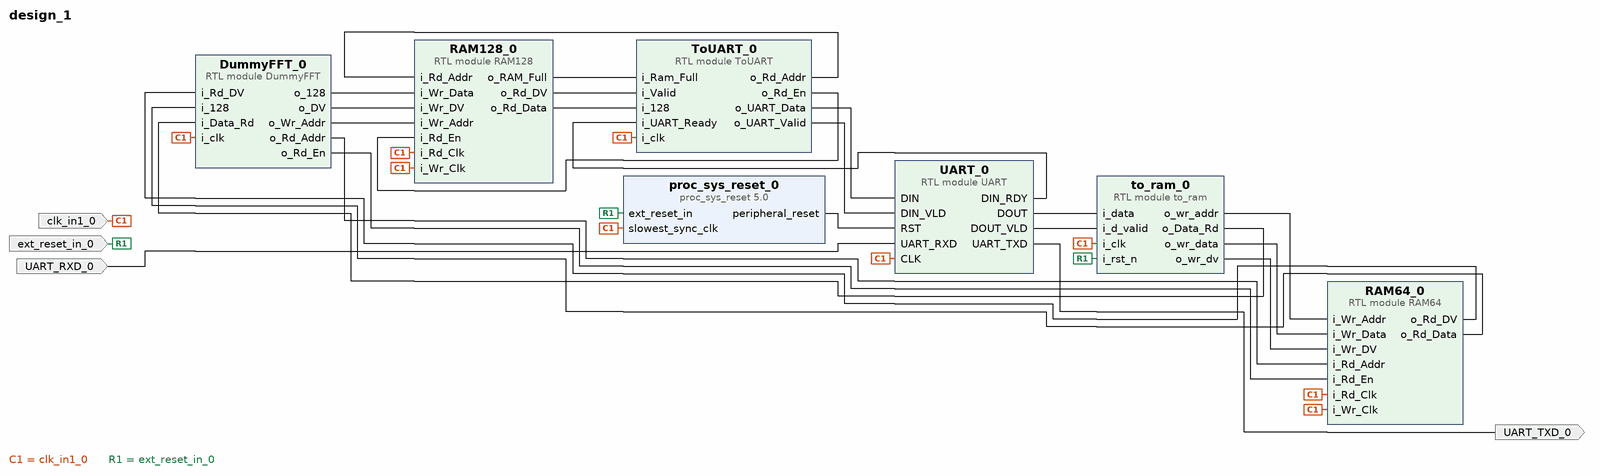
[diagram p0: block diagram of the top level]
# Vivado block design design_1, xc7s25csga324-1, Vivado 2025.1
create_bd_design design_1

create_bd_port -dir I UART_RXD_0
create_bd_port -dir O UART_TXD_0
create_bd_port -dir I -type clk clk_in1_0
set_property -dict {CONFIG.ASSOCIATED_RESET ext_reset_in_0} [get_bd_ports clk_in1_0]
create_bd_port -dir I -type rst ext_reset_in_0

create_bd_cell -type module -reference UART UART_0
create_bd_cell -type ip -vlnv xilinx.com:ip:proc_sys_reset:5.0 proc_sys_reset_0
create_bd_cell -type module -reference to_ram to_ram_0
create_bd_cell -type module -reference ToUART ToUART_0
create_bd_cell -type module -reference RAM64 RAM64_0
create_bd_cell -type module -reference RAM128 RAM128_0
create_bd_cell -type module -reference DummyFFT DummyFFT_0

# ---- connections ----

connect_bd_net [get_bd_pins DummyFFT_0/o_128] [get_bd_pins RAM128_0/i_Wr_Data]
connect_bd_net [get_bd_pins DummyFFT_0/o_DV] [get_bd_pins RAM128_0/i_Wr_DV]
connect_bd_net [get_bd_pins DummyFFT_0/o_Rd_Addr] [get_bd_pins RAM64_0/i_Rd_Addr]
connect_bd_net [get_bd_pins DummyFFT_0/o_Rd_En] [get_bd_pins RAM64_0/i_Rd_En]
connect_bd_net [get_bd_pins DummyFFT_0/o_Wr_Addr] [get_bd_pins RAM128_0/i_Wr_Addr]
connect_bd_net [get_bd_pins RAM128_0/o_RAM_Full] [get_bd_pins ToUART_0/i_Ram_Full]
connect_bd_net [get_bd_pins RAM128_0/o_Rd_DV] [get_bd_pins ToUART_0/i_Valid]
connect_bd_net [get_bd_pins RAM128_0/o_Rd_Data] [get_bd_pins ToUART_0/i_128]
connect_bd_net [get_bd_pins RAM64_0/o_Rd_DV] [get_bd_pins DummyFFT_0/i_Rd_DV]
connect_bd_net [get_bd_pins RAM64_0/o_Rd_Data] [get_bd_pins DummyFFT_0/i_128]
connect_bd_net [get_bd_pins ToUART_0/o_Rd_Addr] [get_bd_pins RAM128_0/i_Rd_Addr]
connect_bd_net [get_bd_pins ToUART_0/o_Rd_En] [get_bd_pins RAM128_0/i_Rd_En]
connect_bd_net [get_bd_pins ToUART_0/o_UART_Data] [get_bd_pins UART_0/DIN]
connect_bd_net [get_bd_pins ToUART_0/o_UART_Valid] [get_bd_pins UART_0/DIN_VLD]
connect_bd_net [get_bd_pins UART_0/DIN_RDY] [get_bd_pins ToUART_0/i_UART_Ready]
connect_bd_net [get_bd_pins UART_0/DOUT] [get_bd_pins to_ram_0/i_data]
connect_bd_net [get_bd_pins UART_0/DOUT_VLD] [get_bd_pins to_ram_0/i_d_valid]
connect_bd_net [get_bd_pins UART_0/UART_TXD] [get_bd_ports UART_TXD_0]
connect_bd_net -net UART_RXD_0_1 [get_bd_ports UART_RXD_0] [get_bd_pins UART_0/UART_RXD]
connect_bd_net -net clk_wiz_1_clk_out1 [get_bd_ports clk_in1_0] \
  [get_bd_pins proc_sys_reset_0/slowest_sync_clk] [get_bd_pins UART_0/CLK] [get_bd_pins ToUART_0/i_clk] \
  [get_bd_pins to_ram_0/i_clk] [get_bd_pins RAM64_0/i_Rd_Clk] [get_bd_pins RAM64_0/i_Wr_Clk] [get_bd_pins RAM128_0/i_Rd_Clk] \
  [get_bd_pins RAM128_0/i_Wr_Clk] [get_bd_pins DummyFFT_0/i_clk]
connect_bd_net -net ext_reset_in_0_1 [get_bd_ports ext_reset_in_0] [get_bd_pins proc_sys_reset_0/ext_reset_in] [get_bd_pins to_ram_0/i_rst_n]
connect_bd_net [get_bd_pins proc_sys_reset_0/peripheral_reset] [get_bd_pins UART_0/RST]
connect_bd_net [get_bd_pins to_ram_0/o_Data_Rd] [get_bd_pins DummyFFT_0/i_Data_Rd]
connect_bd_net [get_bd_pins to_ram_0/o_wr_addr] [get_bd_pins RAM64_0/i_Wr_Addr]
connect_bd_net [get_bd_pins to_ram_0/o_wr_data] [get_bd_pins RAM64_0/i_Wr_Data]
connect_bd_net [get_bd_pins to_ram_0/o_wr_dv] [get_bd_pins RAM64_0/i_Wr_DV]

validate_bd_design
save_bd_design
